# EAGLE design avoccado-avr-pcb-felina-icsp (EAGLE 7.2.0)
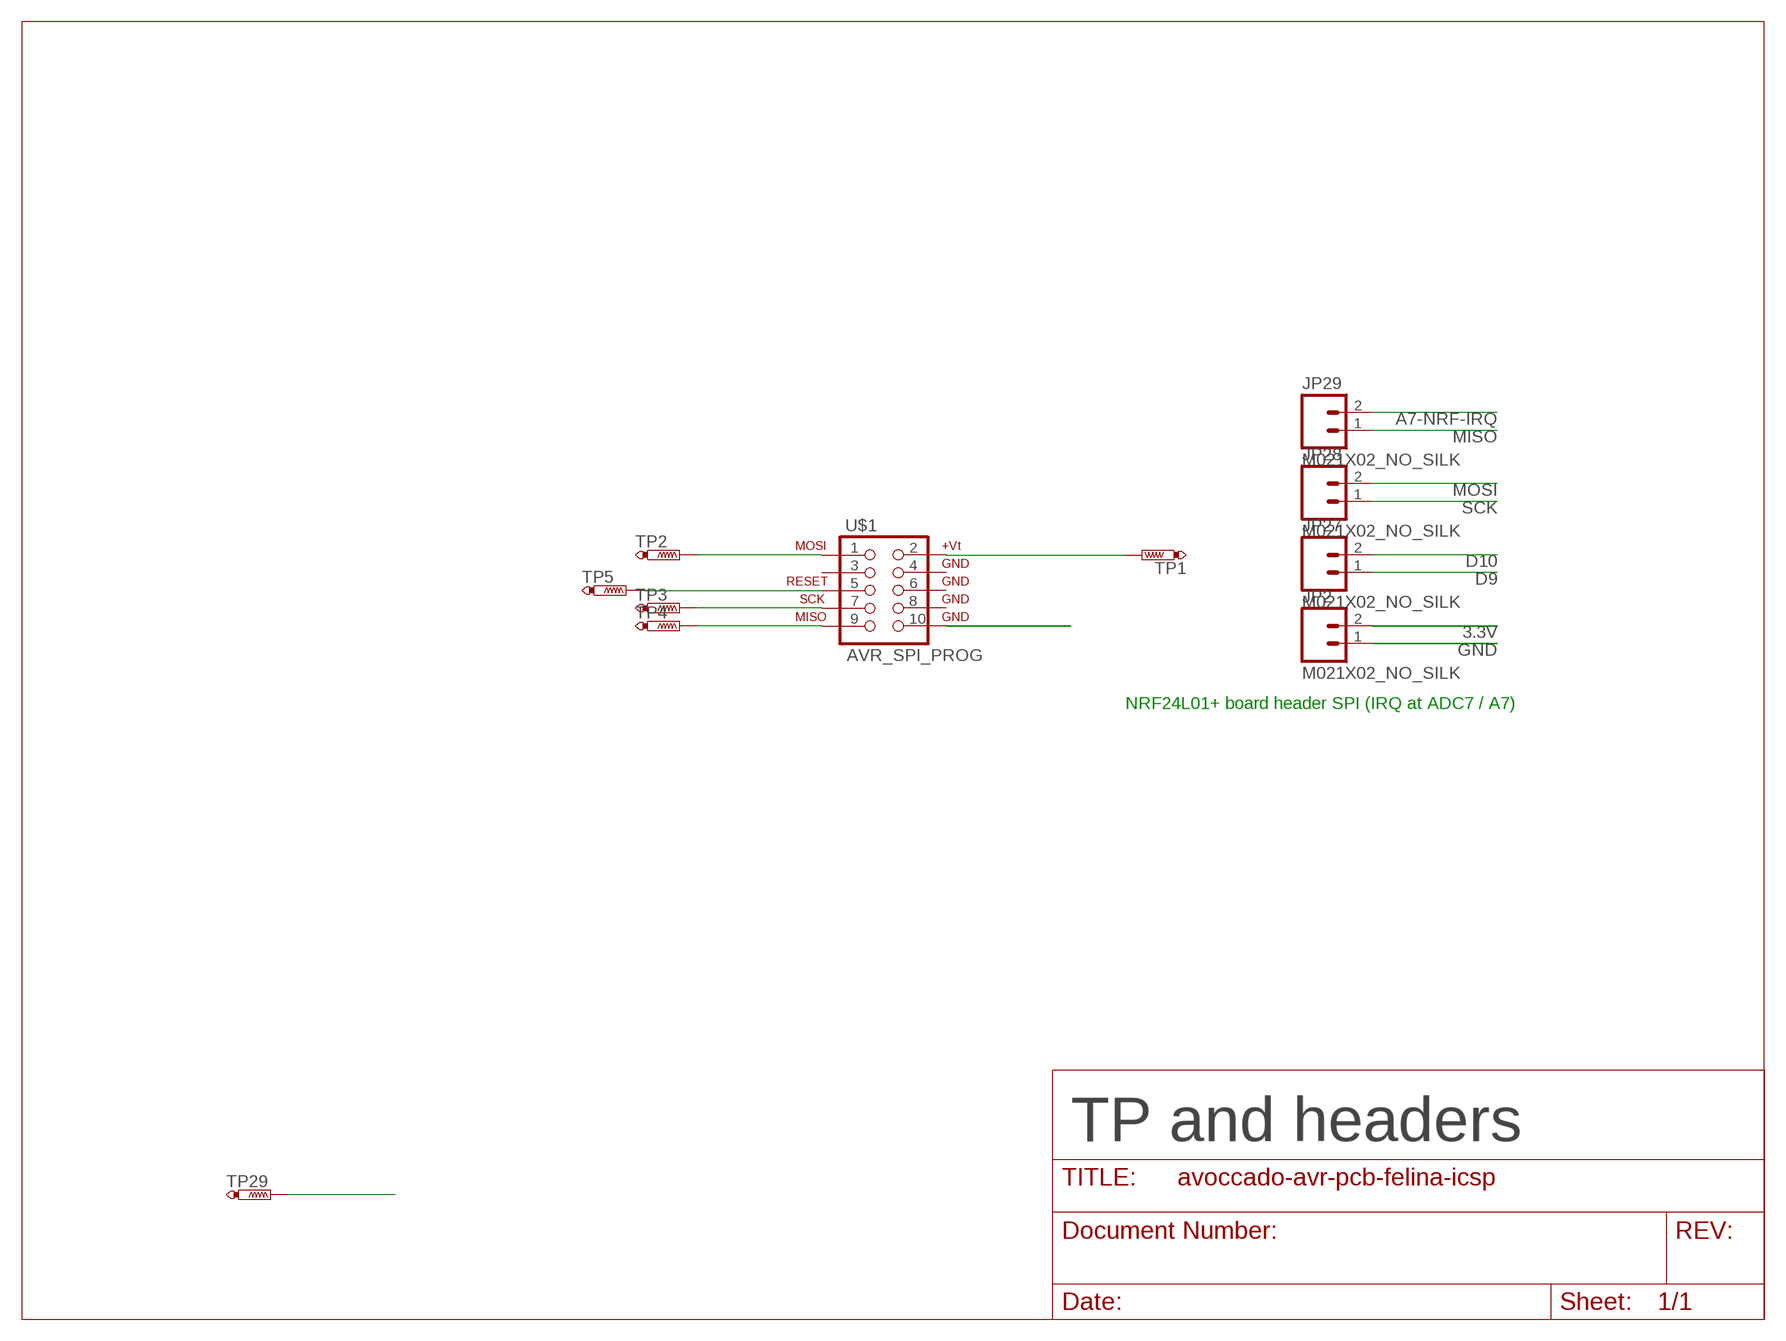
[diagram p0: schematic, sheet 1, part 1 of 2]
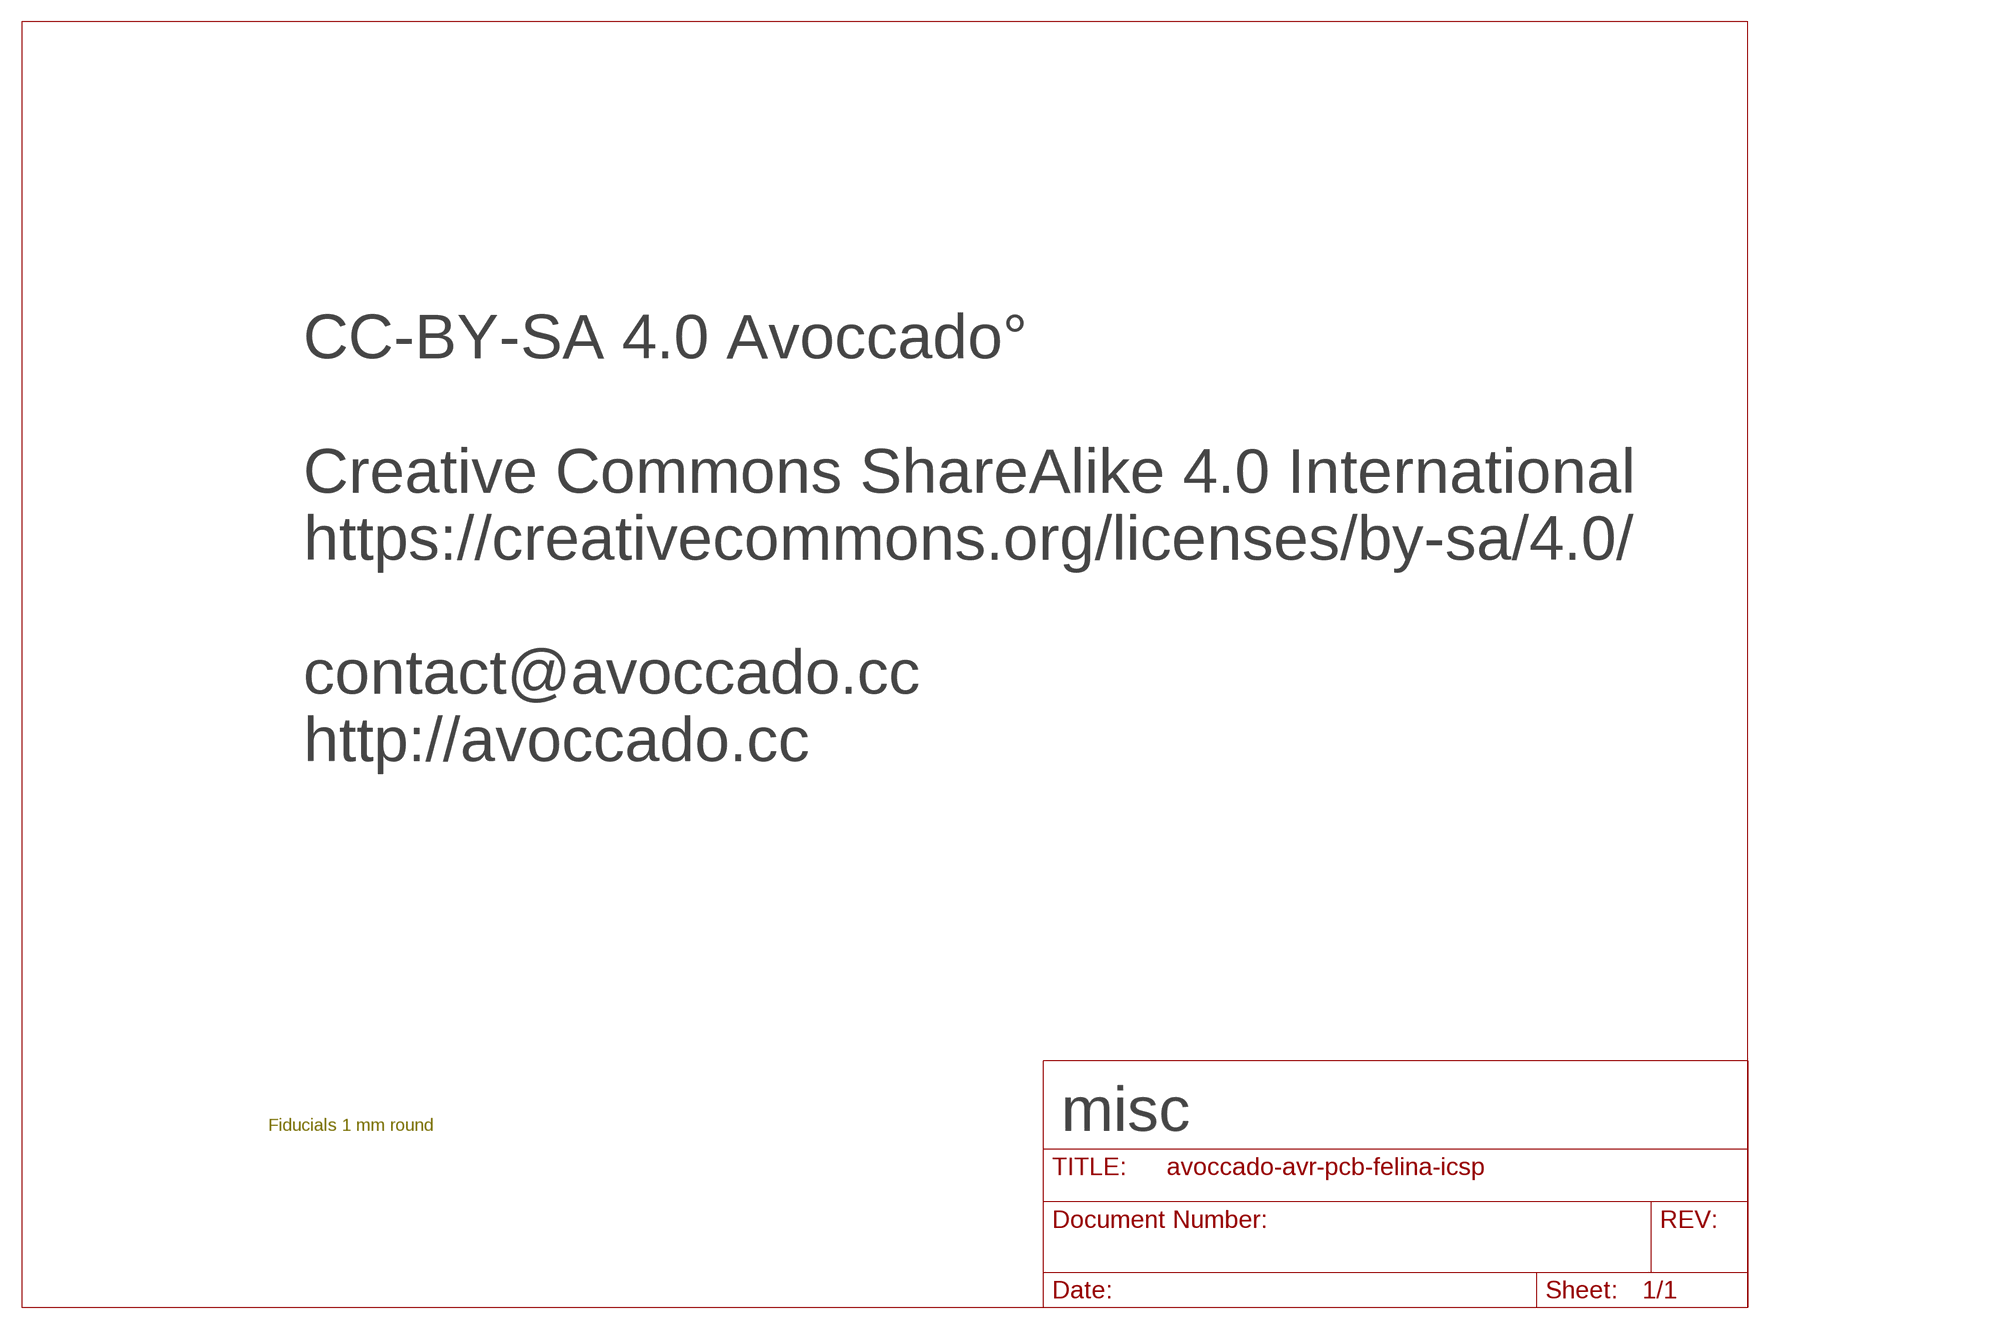
[diagram p1: schematic, sheet 1, part 2 of 2]

## Parts
JP2  M021X02_NO_SILK  [1X02_NO_SILK]
JP27  M021X02_NO_SILK  [1X02_NO_SILK]
JP28  M021X02_NO_SILK  [1X02_NO_SILK]
JP29  M021X02_NO_SILK  [1X02_NO_SILK]
TP1  PTR1PAD1-13  [P1-13]
TP2  PTR1PAD1-13  [P1-13]
TP3  PTR1PAD1-13  [P1-13]
TP4  PTR1PAD1-13  [P1-13]
TP5  PTR1PAD1-13  [P1-13]
TP29  PTR1PAD1-13  [P1-13]
U$1  AVR_SPI_PROG  [AVR_ICSP]

## Nets
3.3V: JP2.2 TP1.TP U$1.2
A7-NRF-IRQ: JP29.2
D9: JP27.1
D10: JP27.2
GND [vcc]: JP2.1 TP29.TP U$1.10
MISO: JP29.1 TP4.TP U$1.9
MOSI: JP28.2 TP2.TP U$1.1
RESET: TP5.TP U$1.5
SCK: JP28.1 TP3.TP U$1.7
Unconnected: U$1.3 U$1.4 U$1.6 U$1.8

## Notes on the sheet
- CC-BY-SA 4.0 Avoccado°
  
  Creative Commons ShareAlike 4.0 International
  https://creativecommons.org/licenses/by-sa/4.0/ 
  
  contact@avoccado.cc
  http://avoccado.cc
- Fiducials 1 mm round | misc
- NRF24L01+ board header SPI (IRQ at ADC7 / A7)
- TP and headers

## Library data of the parts
JP2 JP27-JP29 = SparkFun-Connectors:M02: Standard 2-pin 0.1" header. Use with - straight break away headers ( PRT-00116) - right angle break away headers (PRT-00553) - swiss pins (PRT-00743) - machine pins (PRT-00117) - female headers (PRT-00115) Molex polarized connector foot print use with: PRT-08233 with associated crimp pins and housings. 2.54_SCREWTERM for use with PRT-10571. 3.5mm Screw Terminal footprints for PRT-08084 5mm Screw Terminal footprints for use with PRT-08432
TP1-TP5 TP29 = testpad:PTR1: TEST PIN
U$1 = SparkFun-Connectors:AVR_SPI_PROG: AVR 10-pin ICSP Header This is the standard AVR In Circuit Serial Programming header. Minimal, but includes pin one indicator. Works with standard Olimex programmers. Also look for the 6-pin reduced version. Spark Fun Electronics SKU: PRT-00778

## Net classes
1 vcc: width 0.152 mm
3 usbvcc: width 0.203 mm, drill 0.61 mm, clearance 0.152 mm

## Board
Avoccado PCB AVR
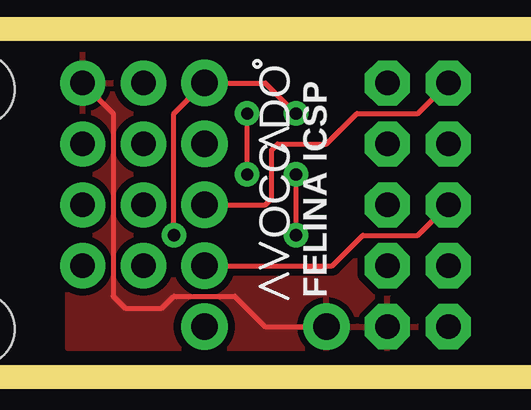
[diagram p2: board, top side]
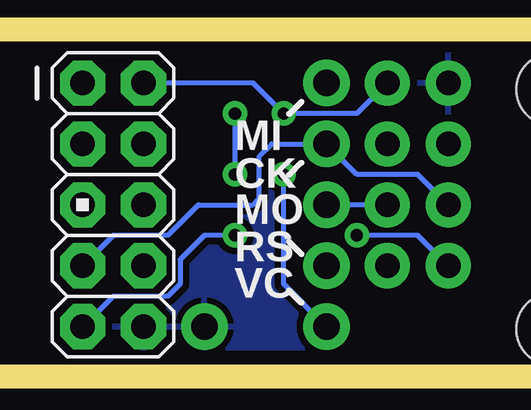
[diagram p3: board, bottom side, seen from below]

No outline drawn. Coordinates in mm, seen from the top.
Copper layers (1*16): Top 0.035mm / dielectric 1.5mm / Bottom 0.035mm
Design rules "SeeedStudio_2layer_DRU_no_angle_20140221 *": minimum track width 6mil, minimum drill 12mil, track to track 6mil, track to pad 6mil, pad to pad 6mil, via to via 6mil, smd to smd 0mil, copper to edge 10mil, drill to drill 10mil, minimum pad ring 10mil, minimum via ring 6mil, stop-mask expansion 0mil, vias tented up to drill 100mil, thermal gap 10mil
Holes 3 mm at 1,6.5 1,16.5 26,6.5 26,16.5
Milling: 8 lines

### Footprints (pad centres in the part's own frame; a part is rotated, then mirrored left to right if it is on the bottom)
1X02_NO_SILK = drill 1.016 pad 1.88: 1 0,0; 2 2.54,0
P1-13 = drill 1.1 pad 1.93: TP 0,0
AVR_ICSP = drill 1.016 pad 1.88 octagon: 1 -1.27,5.08; 2 1.27,5.08; 3 -1.27,2.54; 4 1.27,2.54; 5 -1.27,0; 6 1.27,0; 7 -1.27,-2.54; 8 1.27,-2.54; 9 -1.27,-5.08; 10 1.27,-5.08

### Placement (x,y rotation side)
JP2  5.33,16.76 0 top
JP27  5.33,14.22 0 top
JP28  5.33,11.68 0 top
JP29  5.33,9.14 0 top
TP1  10.41,6.6 0 top
TP2  10.41,11.68 0 top
TP3  10.41,14.22 0 top
TP4  10.41,16.76 0 top
TP5  10.41,9.14 0 top
TP29  15.49,6.6 0 top
U$1  19.3,11.68 0 bottom

### Tracks (layer width: path | path; a pad name or v marks a point on that pad's centre or on a via)
3.3V  (via drill 0.51 pad 1.02)
  Top 0.203: v12.19,12.95 v12.19,15.49
  Bottom 0.203: v12.19,12.95 12.19,8.38 TP1.TP | JP2.2 9.14,15.49 v12.19,15.49 13.46,16.76 U$1.2
GND
  Top 0.203: 5.33,16.25 JP2.1 6.6,15.49 6.6,7.87 7.11,7.36 8.64,7.36 9.14,7.87 11.68,7.87 12.95,6.6 TP29.TP
  pour Bottom (isolate 0.279): 4.72,17.92 22,17.92 21.98,5.71 4.72,5.71
  pour Top (isolate 0.305): 4.72,17.92 4.72,5.71 21.98,5.71 21.98,17.92
MISO  (via drill 0.51 pad 1.02)
  Top 0.203: v9.14,10.41 9.14,15.49 TP4.TP 12.95,16.76 v14.22,15.49 | v14.22,12.95 v14.22,10.41
  Bottom 0.203: U$1.9 19.3,7.87 17.02,7.87 16.51,8.38 16.51,9.39 15.49,10.41 v14.22,10.41 | JP29.1 6.6,10.41 v9.14,10.41 | v14.22,15.49 v14.22,12.95
MOSI
  Top 0.203: TP2.TP 12.95,11.68 13.21,11.93 13.21,13.97 13.46,14.22 15.49,14.22 16.76,15.49 19.3,15.49 U$1.1
  Bottom 0.203: JP28.2 TP2.TP
RESET
  Top 0.203: TP5.TP 15.75,9.14 17.02,10.41 19.3,10.41 U$1.5
SCK
  Bottom 0.203: U$1.7 19.3,10.41 17.02,10.41 15.75,11.68 13.46,11.68 13.21,11.93 13.21,13.71 12.7,14.22 TP3.TP 9.14,12.95 6.6,12.95 JP28.1

### Text on the board
tPlace: OCC DO | FELINA ICSP
bPlace: MI | CK | MO | RS | VC